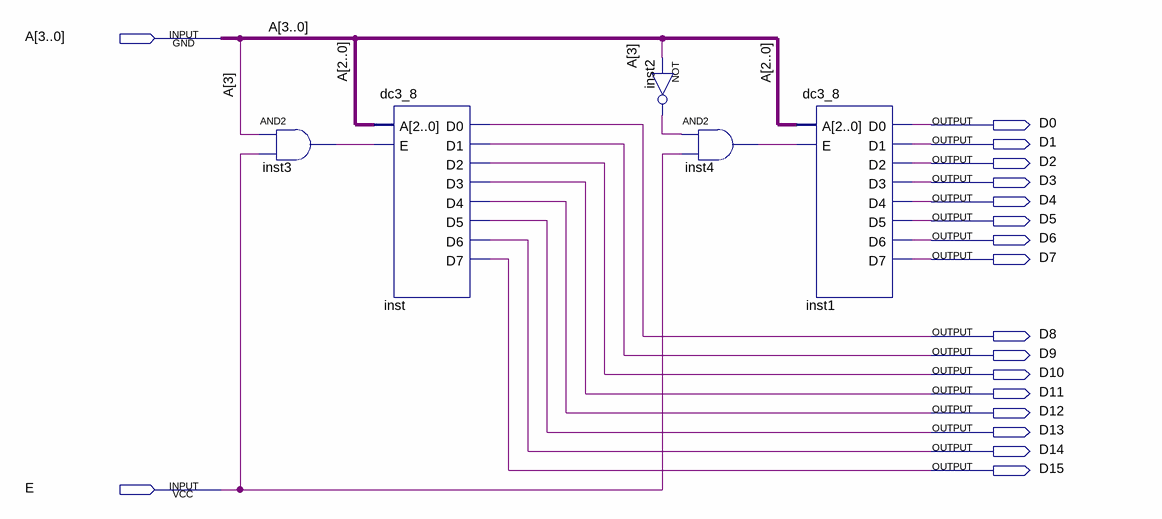
[diagram p0: schematic sheet]
// Quartus schematic dc4_16.bdf as structural Verilog: 5 symbols, 18 pins
module dc4_16 (
  input  [3:0] A,
  input  E,
  output D0,
  output D1,
  output D2,
  output D3,
  output D4,
  output D5,
  output D6,
  output D7,
  output D8,
  output D9,
  output D10,
  output D11,
  output D12,
  output D13,
  output D14,
  output D15
);

  wire inst2_out, inst3_out, inst4_out;

  and inst3 (inst3_out, A[3], E);
  dc3_8 inst (.A(A[2:0]), .E(inst3_out), .D0(D8), .D1(D9), .D2(D10), .D3(D11), .D4(D12), .D5(D13), .D6(D14), .D7(D15));
  not inst2 (inst2_out, A[3]);
  and inst4 (inst4_out, inst2_out, E);
  dc3_8 inst1 (.A(A[2:0]), .E(inst4_out), .D0(D0), .D1(D1), .D2(D2), .D3(D3), .D4(D4), .D5(D5), .D6(D6), .D7(D7));
endmodule
